# EAGLE schematic CHIP4 DUT Adapter Board (EAGLE 7.1.0)
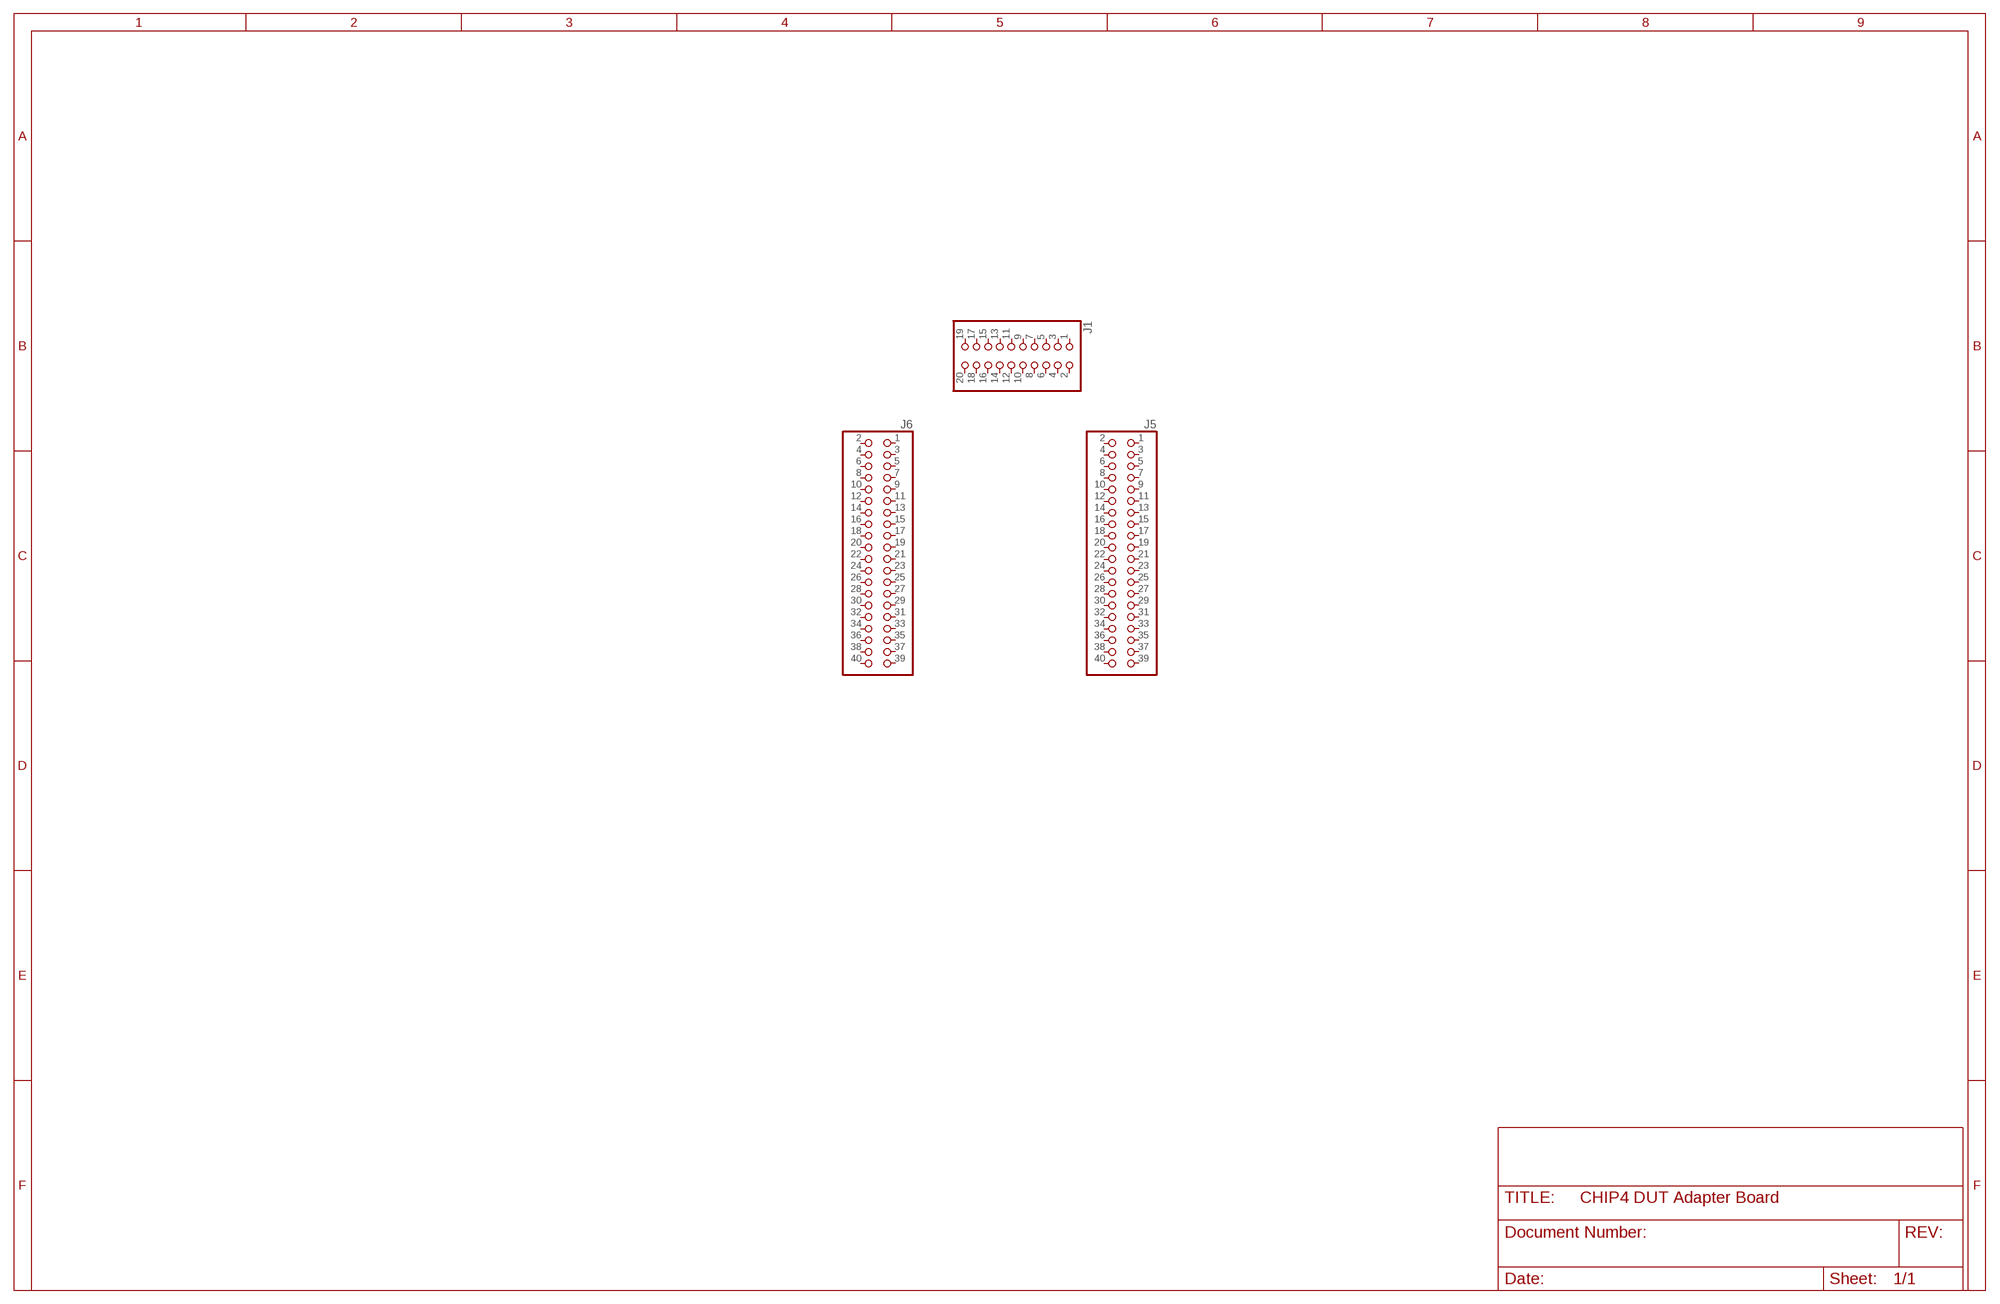
[diagram p0: schematic, sheet 1]

## Parts
J1  PINHD-2X10  [2X10]
J5  PINHD-2X20  [2X20]
J6  PINHD-2X20  [2X20]
Unconnected: J1.1 J1.2 J1.3 J1.4 J1.5 J1.6 J1.7 J1.8 J1.9 J1.10 J1.11 J1.12 J1.13 J1.14 J1.15 J1.16 J1.17 J1.18 J1.19 J1.20 J5.1 J5.2 J5.3 J5.4 J5.5 J5.6 J5.7 J5.8 J5.9 J5.10 J5.11 J5.12 J5.13 J5.14 J5.15 J5.16 J5.17 J5.18 J5.19 J5.20 J5.21 J5.22 J5.23 J5.24 J5.25 J5.26 J5.27 J5.28 J5.29 J5.30 J5.31 J5.32 J5.33 J5.34 J5.35 J5.36 J5.37 J5.38 J5.39 J5.40 J6.1 J6.2 J6.3 J6.4 J6.5 J6.6 J6.7 J6.8 J6.9 J6.10 J6.11 J6.12 J6.13 J6.14 J6.15 J6.16 J6.17 J6.18 J6.19 J6.20 J6.21 J6.22 J6.23 J6.24 J6.25 J6.26 J6.27 J6.28 J6.29 J6.30 J6.31 J6.32 J6.33 J6.34 J6.35 J6.36 J6.37 J6.38 J6.39 J6.40

## Library data of the parts
J1 = pinhead:PINHD-2X10: PIN HEADER
J5 J6 = pinhead:PINHD-2X20: PIN HEADER